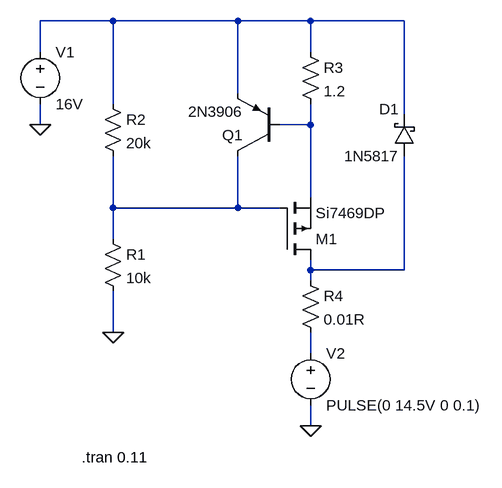
[diagram p0: schematic Charger.asc]
Charger.asc, the LTspice schematic file:
Version 4
SHEET 1 880 680
WIRE 0 -48 -112 -48
WIRE 192 -48 0 -48
WIRE 304 -48 192 -48
WIRE 448 -48 304 -48
WIRE -112 0 -112 -48
WIRE 304 0 304 -48
WIRE 192 64 192 -48
WIRE 0 80 0 -48
WIRE 448 96 448 -48
WIRE -112 112 -112 80
WIRE 304 112 304 80
WIRE 304 112 256 112
WIRE 304 224 304 112
WIRE 0 240 0 160
WIRE 192 240 192 160
WIRE 192 240 0 240
WIRE 256 240 192 240
WIRE 0 288 0 240
WIRE 304 336 304 320
WIRE 448 336 448 160
WIRE 448 336 304 336
WIRE 304 352 304 336
WIRE 0 432 0 368
WIRE 304 464 304 432
WIRE 304 576 304 544
FLAG 0 432 0
FLAG 304 576 0
FLAG -112 112 0
SYMBOL res -16 272 R0
SYMATTR InstName R1
SYMATTR Value 10k
SYMBOL res -16 64 R0
SYMATTR InstName R2
SYMATTR Value 20k
SYMBOL pmos 256 320 M180
SYMATTR InstName M1
SYMATTR Value Si7469DP
SYMBOL res 288 -16 R0
SYMATTR InstName R3
SYMATTR Value 1.2
SYMBOL pnp 256 160 R180
SYMATTR InstName Q1
SYMATTR Value 2N3906
SYMBOL res 288 336 R0
SYMATTR InstName R4
SYMATTR Value 0.01R
SYMBOL voltage -112 -16 R0
WINDOW 123 0 0 Left 0
WINDOW 39 0 0 Left 0
SYMATTR InstName V1
SYMATTR Value 16V
SYMBOL voltage 304 448 R0
WINDOW 123 0 0 Left 0
WINDOW 39 0 0 Left 0
SYMATTR InstName V2
SYMATTR Value PULSE(0 14.5V 0 0.1)
SYMBOL schottky 464 160 R180
WINDOW 0 24 72 Left 0
WINDOW 3 24 0 Left 0
SYMATTR InstName D1
SYMATTR Value 1N5817
SYMATTR Description Diode
SYMATTR Type diode
TEXT -48 624 Left 0 !.tran 0.11

The netlist it stands for:
* Charger.asc
R1 N003 0 10k
R2 N001 N003 20k
M1 N004 N003 N002 N002 Si7469DP
R3 N001 N002 1.2
Q1 N003 N002 N001 0 2N3906
R4 N004 N005 0.01R
V1 N001 0 16V
V2 N005 0 PULSE(0 14.5V 0 0.1)
D1 N004 N001 1N5817
.model D D
.lib standard.dio
.model NPN NPN
.model PNP PNP
.lib standard.bjt
.model NMOS NMOS
.model PMOS PMOS
.lib standard.mos
.tran 0.11
.backanno
.end